# Altium schematic sheet GND Loop.SchDoc
size A4
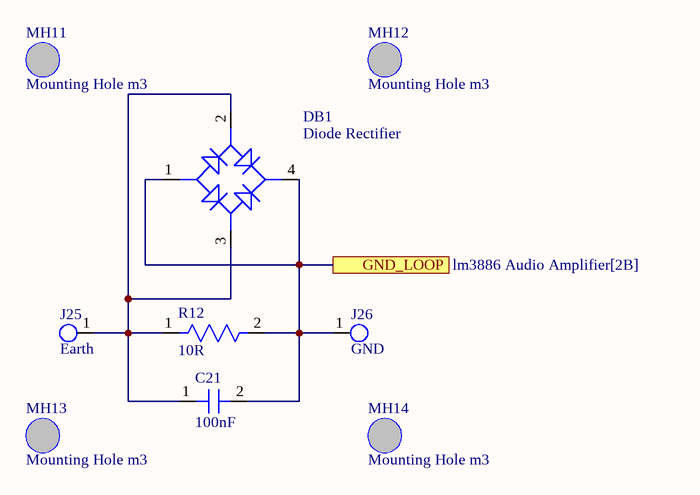
[diagram p0: GND Loop.SchDoc]

## Parts
C21  100nF  [Capacitor P15 7.2x18.3mm]
DB1  Diode Rectifier  [KBPC rectifier]
J25  Earth  [Terminal 6.3mm male]
J26  GND  [Terminal 6.3mm male]
MH11  Mounting Hole m3  [Mounting Hole]
MH12  Mounting Hole m3  [Mounting Hole]
MH13  Mounting Hole m3  [Mounting Hole]
MH14  Mounting Hole m3  [Mounting Hole]
R12  10R  [Resistor 0823 5W]

## Ports
GND_LOOP (see lm3886 Audio Amplifier[2B])

## Nets
GND_LOOP: C21.2 DB1.1 DB1.4 J26.1 R12.2 ; port GND_LOOP
NetC21_1: C21.1 DB1.2 DB1.3 J25.1 R12.1

## Library data of the parts
C21 = Capacitor
J25 J26 = 6.3mm Male Terminal
R12 = Resistor